# Altium schematic sheet RoboFut.SchDoc
size Tabloid; SheetNumber: 1; SheetTotal: 1
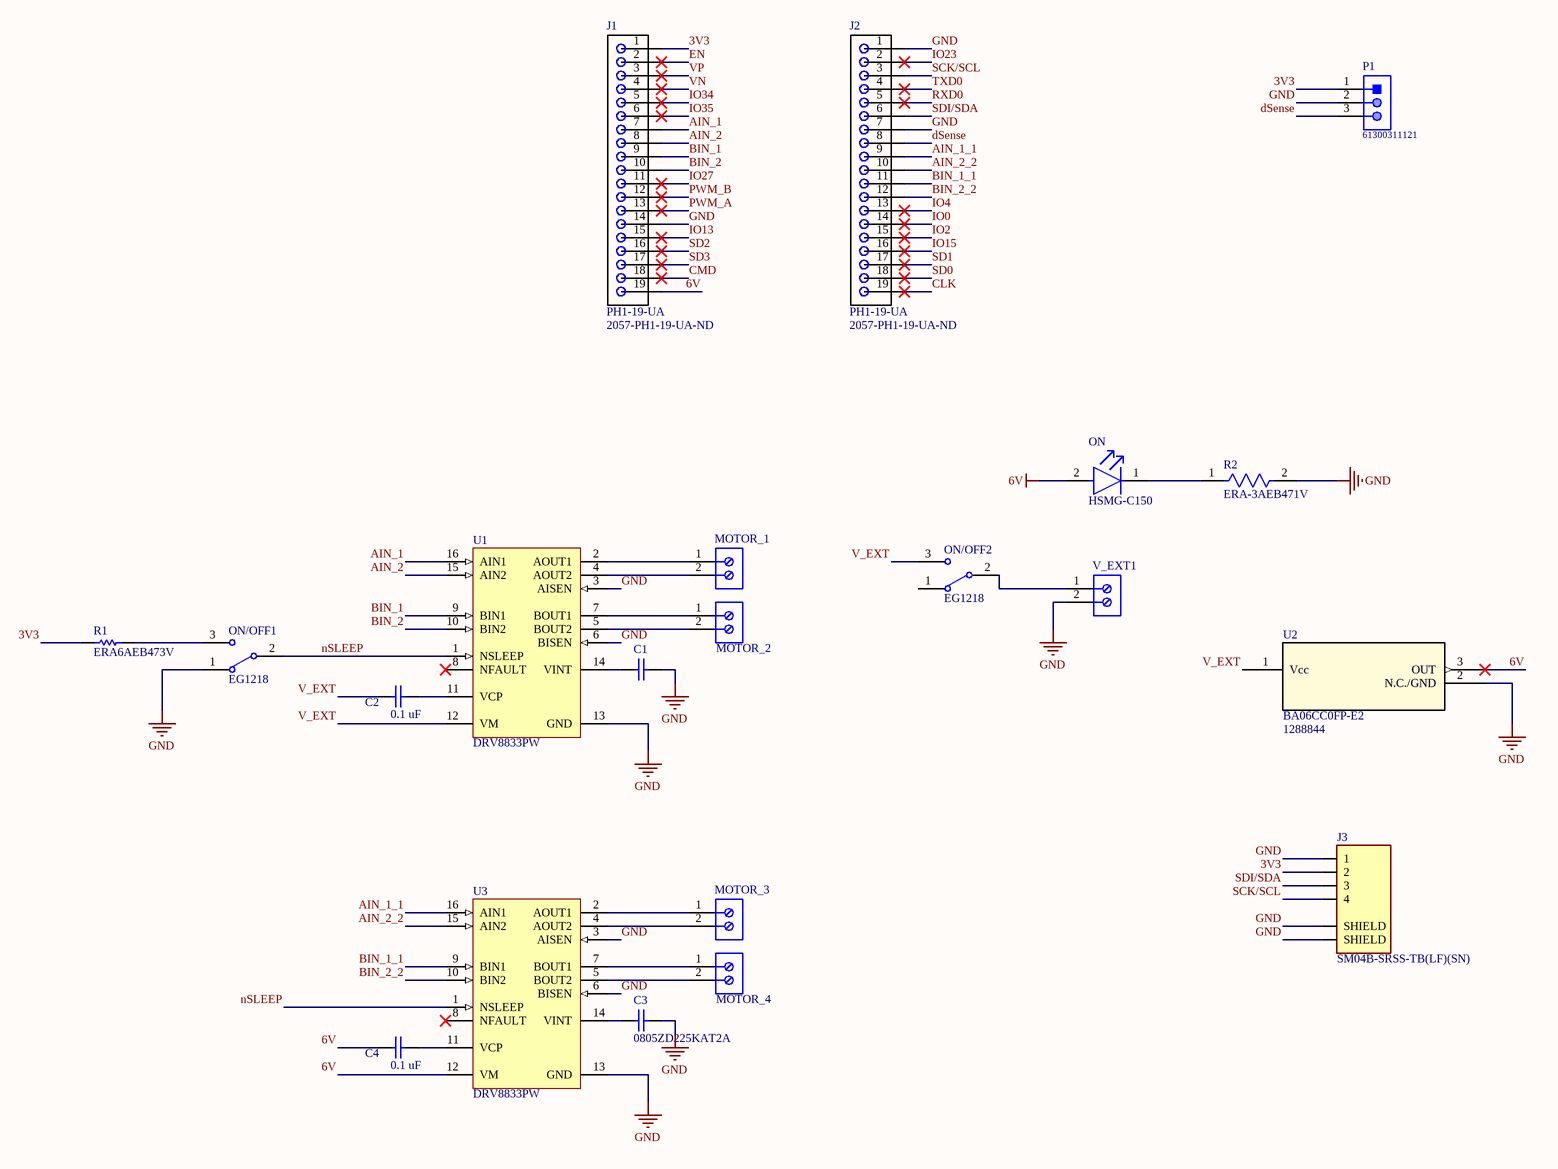
[diagram p0: RoboFut.SchDoc]

## Parts
C1  0805ZD225KAT2A  [CAPC2013X140X50ML20T25]  (value not drawn)
C2  0.1 uF  [CAPC2013X94X50ML20T25]
C3  0805ZD225KAT2A  [CAPC2013X140X50ML20T25]
C4  0.1 uF  [CAPC2013X94X50ML20T25]
J1  PH1-19-UA  Supplier Part Number 1: 2057-PH1-19-UA-ND  [PH1-19-UA - Socket]
J2  PH1-19-UA  Supplier Part Number 1: 2057-PH1-19-UA-ND  [PH1-19-UA - Socket]
J3  SM04B-SRSS-TB(LF)(SN)  [JST_SM04B-SRSS-TB(LF)(SN)]
MOTOR_1  691214110002  [691214110002]  (value not drawn)
MOTOR_2  691214110002  [691214110002]  (value not drawn)
MOTOR_3  691214110002  [691214110002]  (value not drawn)
MOTOR_4  691214110002  [691214110002]  (value not drawn)
ON  HSMG-C150  [FP-HSMG-C150-MFG]
ON/OFF1  EG1218  [ESWI-EG1218_V]
ON/OFF2  EG1218  [ESWI-EG1218_V]
P1  61300311121  [61300311121]
R1  ERA6AEB473V  [RESC2013X60X40ML20T25]
R2  ERA-3AEB471V  [FP-ERA3A-IPC_A]
U1  DRV8833PW  [PW0016A_M]
U2  BA06CC0FP-E2  Supplier Part Number 1: 1288844  [TO252-3_ROM-M]
U3  DRV8833PW  [PW0016A_M]
V_EXT1  691214110002  [691214110002]  (value not drawn)

## Nets
6V: C4.2 J1.19 ON.2(A) U2.3(OUT) U3.12(VM)
GND: C1.2 C3.2 J1.14 J2.1 J2.7 J3.1 J3.S1(SHIELD) J3.S2(SHIELD) ON/OFF1.1 P1.2 R2.2 U1.3(AISEN) U1.6(BISEN) U1.13(GND) U2.2(N.C./GND) U3.3(AISEN) U3.6(BISEN) U3.13(GND) V_EXT1.2
3V3: J1.1 J3.2 P1.1 R1.2
AIN_1: J1.7 U1.16(AIN1)
AIN_1_1: J2.9 U3.16(AIN1)
AIN_2: J1.8 U1.15(AIN2)
AIN_2_2: J2.10 U3.15(AIN2)
BIN_1: J1.9 U1.9(BIN1)
BIN_1_1: J2.11 U3.9(BIN1)
BIN_2: J1.10 U1.10(BIN2)
BIN_2_2: J2.12 U3.10(BIN2)
CLK: J2.19
CMD: J1.18
dSense: J2.8 P1.3
EN: J1.2
IO0: J2.14
IO2: J2.15
IO4: J2.13
IO13: J1.15
IO15: J2.16
IO23: J2.2
IO27: J1.11
IO34: J1.5
IO35: J1.6
nSLEEP: ON/OFF1.2(COM) U1.1(NSLEEP) U3.1(NSLEEP)
PWM_A: J1.13
PWM_B: J1.12
RXD0: J2.5
SCK/SCL: J2.3 J3.4
SD0: J2.18
SD1: J2.17
SD2: J1.16
SD3: J1.17
SDI/SDA: J2.6 J3.3
TXD0: J2.4
V_EXT: C2.2 ON/OFF2.3 U1.12(VM) U2.1(Vcc)
VN: J1.4
VP: J1.3
NetC1_1: C1.1 U1.14(VINT)
NetC2_1: C2.1 U1.11(VCP)
NetC3_1: C3.1 U3.14(VINT)
NetC4_1: C4.1 U3.11(VCP)
NetMOTOR_1_1: MOTOR_1.1 U1.2(AOUT1)
NetMOTOR_1_2: MOTOR_1.2 U1.4(AOUT2)
NetMOTOR_2_1: MOTOR_2.1 U1.7(BOUT1)
NetMOTOR_2_2: MOTOR_2.2 U1.5(BOUT2)
NetMOTOR_3_1: MOTOR_3.1 U3.2(AOUT1)
NetMOTOR_3_2: MOTOR_3.2 U3.4(AOUT2)
NetMOTOR_4_1: MOTOR_4.1 U3.7(BOUT1)
NetMOTOR_4_2: MOTOR_4.2 U3.5(BOUT2)
NetON/OFF1_3: ON/OFF1.3 R1.1
NetON/OFF2_2: ON/OFF2.2(COM) V_EXT1.1
NetON_1: ON.1(C) R2.1

Not connected (* = marked no-connect by the designer): ON/OFF2 1; U1 8(NFAULT)*; U3 8(NFAULT)*

## Library data of the parts
C1 C3 = CMP-2000-05810-1: Chip Capacitor, 2.2 uF, +/- 10%, 10 V, -55 to 85 degC, 0805 (2012 Metric), RoHS, Tape and Reel; Manufacturer: AVX; Dielectric: X5R; Rated Voltage: 10V; Capacitance: 2.2µF; Tolerance (%): ±10%; Datasheet Version: 05/2016; Manufacturer URL: http://www.avx.com/; Package Description: 2-Pin Surface Mount Device, Body 2.01 x 1.25 mm; Mounting Technology: SurfaceMount; Case Size/Dimension: 0805; Package Reference: 0805; Datasheet URL: http://datasheets.avx.com/cx5r.pdf
C2 C4 = CMP-2000-05016-1: Chip Capacitor, Ceramic, 0.1 uF, 10%, 50 V, 0805, RoHS, Tape and Reel; Manufacturer: AVX; Rated Voltage: 50V; Capacitance: 100nF; Dielectric: X7R; Case Size/Dimension: 0805; Tolerance (%): ±10%; Datasheet URL: http://www.farnell.com/datasheets/319609.pdf; Datasheet Version: Sep-07; Manufacturer URL: http://www.avx.com/
J1 J2 = PH1-19-UA: Connector Header Through Hole 19 position 0.100" (2.54mm); Supplier 1: Digi-Key
J3 = SM04B-SRSS-TB(LF)(SN): Connector Header Surface Mount, Right Angle 4 position 0.039 _1.00mm_; MF: JST Sales; MP: SM04B-SRSS-TB_LF__SN_; Price: None; SnapEDA_Link: https://www.snapeda.com/parts/SM04B-SRSS-TB%28LF%29%28SN%29/JST%20Sales%20America%20Inc./view-part/557466/?ref=snap; Value: *; Availability: Unavailable; Package: None
MOTOR_1-MOTOR_4 V_EXT1 = CMP-1502-02464-1: Serie 2141 - 3.50 mm Horizontal Entry Modular with Rising Cage Clamp WR-TBL, 2 pin; Manufacturer: Wurth Elektronik; Pin Number: 2; Pitch: 3.50mm; Datasheet URL: http://katalog.we-online.de/em/datasheet/6912141100xx.pdf; Packaging: Box; Mounting Technology: THT; Package Reference: 691214110002; Manufacturer URL: http://www.we-online.de; Part Number: 691214110002; Publisher: WurthElektronik; Operating Temperature: -40to105degC
ON = CMP-2000-05061-2: LED GREEN DIFFUSED 1206 SMD; Manufacturer: Broadcom; Led Orientation: Top View; Max Junction Temp: +95°C; Peak Emmision Wavelength: 570nm; Viewing Angle: 170°; Wavelength: 572nm; Reverse Voltage: 5V; Luminous Intensity: 15mcd; Forward Voltage: 2.2V; Power Dissipation: 65mW; Forward Current: 20mA; ComponentLink2Description: Datasheet; Lead Free: Yes; Temperature Range Low: -40°C; Package: HSMG-C150; Digikey Description: LED GREEN DIFFUSED 1206 SMD; Mouser Description: LED Uni-Color Green 570nm 2-Pin Chip LED T/R; Manufacturer Part Number: HSMG-C150; Temperature Range High: +85°C; Device Class L1: Optoelectronics; Colour: Green; Category: Diode; Device Class L3: unset; RoHS: TRUE; Height: 1.2mm; ComponentLink2URL: https://docs.broadcom.com/docs/AV02-0551EN; Device Class L2: LEDs; Automotive: No; Ipc Land Pattern Name: DIOCP320160X55; Octopart: https://octopart.com/hsmg-c150-broadcom-71131304; Temperature: -40°C to +85°C
ON/OFF1 ON/OFF2 = CMP-1696-00002-1: Slide Switch, 500 V, -20 to 70 degC, 3-Pin THD, RoHS; Case\Package: SOT-23-5; Output Current: 150 mA; Nominal Output Voltage: 3.3 V; Max Power Dissipation: 250 mW; Min Input Voltage: 4.3 V; Outputs: 1; Max Input Voltage: 8 V; Dropout Voltage: 300 mV; PackageDescription: 3-Pin Through Hole Device, Body 11.6 x 4 mm, Pitch 2.5 mm; ComponentLink1URL: http://www.e-switch.ch/en/; RoHSCompliant: true; Length: 3 mm; ComponentLink1Description: Manufacturer URL; Power Rating: 250 mW; Mount: Surface Mount; Max Operating Temperature: 85 degC; REACH SVHC: No SVHC; Radiation Hardening: No; Height: 1.3 mm; Pins: 5; Max Ouput Current: 150 mA; Output Voltage: 3.3 V; Width: 1.8 mm; Package Quantity: 3000; ComponentLink2URL: https://www.e-switch.com/system/asset/product_line/data_sheet/119/EG.pdf; Min Operating Temperature: -40 degC; ComponentLink2Description: Datasheet; DatasheetVersion: Oct-15; PackageReference: EG1218; Packaging: Tape and Reel
P1 = CMP-1502-01062-1: THT Vertical Pin Header WR-PHD, Pitch 2.54 mm, Single Row, 3 pins; Manufacturer: Wurth Elektronik; Withstanding Voltage: 500VAC; Working Voltage: 250VAC; Rated Current: 3A; Pitch: 2.54mm; Pin Number: 3; Gender: Male; Contact Resistance: 20mOhm; Package Reference: 61300311121; Manufacturer URL: http://www.we-online.de; Datasheet URL: https://katalog.we-online.de/em/datasheet/6130xx11121.pdf; Operating Temperature: -40to105degC; Part Number: 61300311121; Orientation: Vertical; Packaging: Bag; Row Number: Single; Mounting Technology: THT; Publisher: WurthElektronik
R1 = CMP-2001-00645-1: Manufacturer: Panasonic; Part Number: ERA6AEB473V
R2 = CMP-2000-00071-2: RES SMD 470 OHM 0.1% 1/10W 0603; Temperature Coefficient: 25ppm/°C; Power Rating: 100mW; Voltage Rating: 75V; Resistance: 470R; Mount: Surface Mount; Size Code: 0603; Contact Plating: Tin; Military Standard: Not; Resistor Type: Thin Film; Width: 0.8mm; Length: 1.6mm; Technology: THIN FILM; RoHS Compliant: Yes; Number of Terminations: 2; Series: ERA-3A; Number of Pins: 2; Construction: Rectangular; Radiation Hardening: No; Max Operating Temperature: 155°C; Termination: SMD/SMT; Case Code (Imperial): 0603; Case Code (Metric): 1608; Tolerance: 0.1%; Packaging: Tape and Reel; Depth: 0.8mm; REACH SVHC: No SVHC; Case/Package: 0603; Min Operating Temperature: -55°C; Lead Free: Lead Free; Package Quantity: 1; Resistance Tolerance: 0.1%; Voltage Rating (DC): 75V; Max Power Dissipation: 100mW; Features: Automotive AEC-Q200; Height: 0.45mm
U1 U3 = CMP-1529-00002-2: 2 A Low Voltage Dual Brushed DC or Single Bipolar Stepper Motor Driver (PWM Ctrl), 2.7 to 10.8 V, -40 to 85 degC, 16-Pin SOP (PW), Green (RoHS & no Sb/Br), Tube; Manufacturer: Texas Instruments; Peak Output Current: 2 A; RMS Output Current: 1.5 A; Vs: 2.7 V Min.; rDS (ON) (LS + HS): 360 mOhms; PackageVersion: 4040064-4/G; Temperature Range: -40 to 85 degC; ComponentLink2Description: Datasheet; Mounting Technology: Surface Mount; DatasheetVersion: SLVSAR1D; Control I/F: PWM; Eco-Plan: Green (RoHS & no Sb/Br); ComponentLink3URL: http://www.ti.com/lit/ml/mpds361/mpds361.pdf; ComponentLink1Description: Manufacturer URL; PartNumber: DRV8833PW; Package Reference: PW0016A; Packing: Tube; PackageDescription: 16-Pin Plastic Small Outline, Body 4.4 x 5 mm, Pitch 0.65 mm; ComponentLink3Description: Package Specification; ComponentLink1URL: www.ti.com; ComponentLink2URL: http://www.ti.com/lit/ds/symlink/drv8833.pdf
U2 = BA06CC0FP-E2: Linear Voltage Regulator IC Positive Fixed 1 Output 1A TO-252; Mfr_Name: ROHM Semiconductor; Copyright: Copyright (C) 2022 Ultra Librarian. All rights reserved.; Manufacturer_Part_Number: BA06CC0FP-E2; Digi-Key_Part_Number_1: BA06CC0FP-E2TR-ND; Digi-Key_Part_Number_2: BA06CC0FP-E2CT-ND; Digi-Key_Part_Number_3: BA06CC0FP-E2DKR-ND; RefDes: RefDes; Type: DEV; Supplier 1: RSComponents